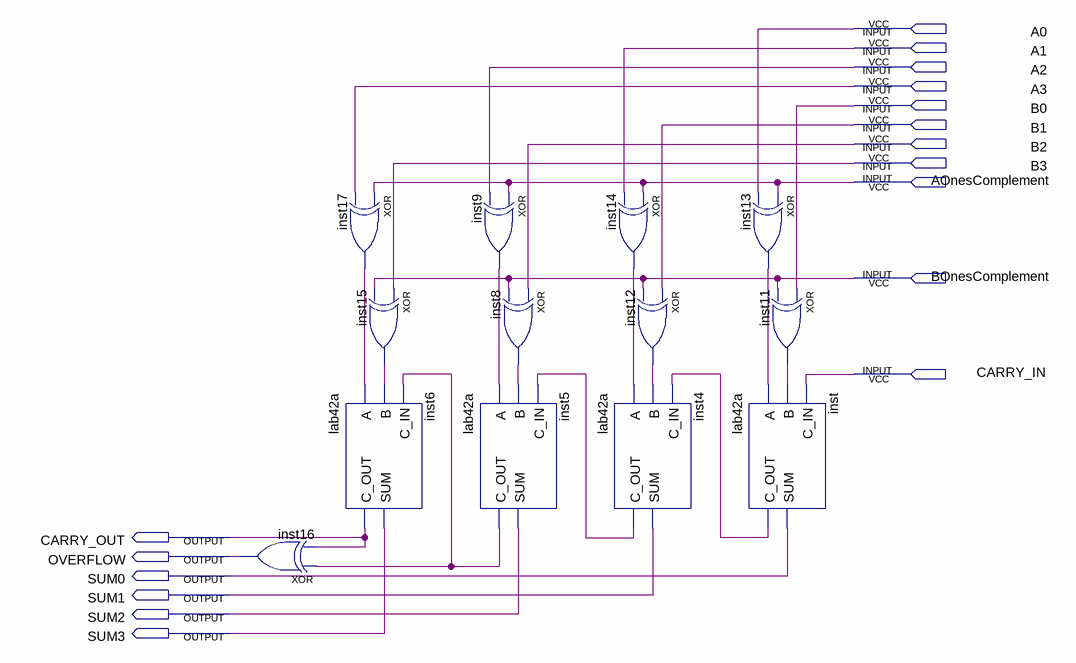
[diagram p0: schematic sheet]
// Quartus schematic FullAdder4bits.bdf as structural Verilog: 13 symbols, 17 pins
module FullAdder4bits (
  input  A0,
  input  A1,
  input  A2,
  input  A3,
  input  B0,
  input  B1,
  input  B2,
  input  B3,
  input  AOnesComplement,
  input  BOnesComplement,
  input  CARRY_IN,
  output CARRY_OUT,
  output OVERFLOW,
  output SUM0,
  output SUM1,
  output SUM2,
  output SUM3
);

  wire inst4_c_out, inst5_c_out, inst8_out, inst9_out, inst11_out, inst12_out, inst13_out, inst14_out,
       inst15_out, inst17_out, inst_c_out;

  xor inst16 (OVERFLOW, inst5_c_out, CARRY_OUT);
  xor inst17 (inst17_out, AOnesComplement, A3);
  xor inst15 (inst15_out, B3, BOnesComplement);
  lab42a inst6 (.A(inst17_out), .B(inst15_out), .C_IN(inst5_c_out), .C_OUT(CARRY_OUT), .SUM(SUM3));
  xor inst9 (inst9_out, AOnesComplement, A2);
  xor inst8 (inst8_out, B2, BOnesComplement);
  lab42a inst5 (.A(inst9_out), .B(inst8_out), .C_IN(inst4_c_out), .C_OUT(inst5_c_out), .SUM(SUM2));
  xor inst14 (inst14_out, AOnesComplement, A1);
  xor inst12 (inst12_out, B1, BOnesComplement);
  lab42a inst4 (.A(inst14_out), .B(inst12_out), .C_IN(inst_c_out), .C_OUT(inst4_c_out), .SUM(SUM1));
  xor inst13 (inst13_out, AOnesComplement, A0);
  lab42a inst (.A(inst13_out), .B(inst11_out), .C_IN(CARRY_IN), .C_OUT(inst_c_out), .SUM(SUM0));
  xor inst11 (inst11_out, B0, BOnesComplement);
endmodule
